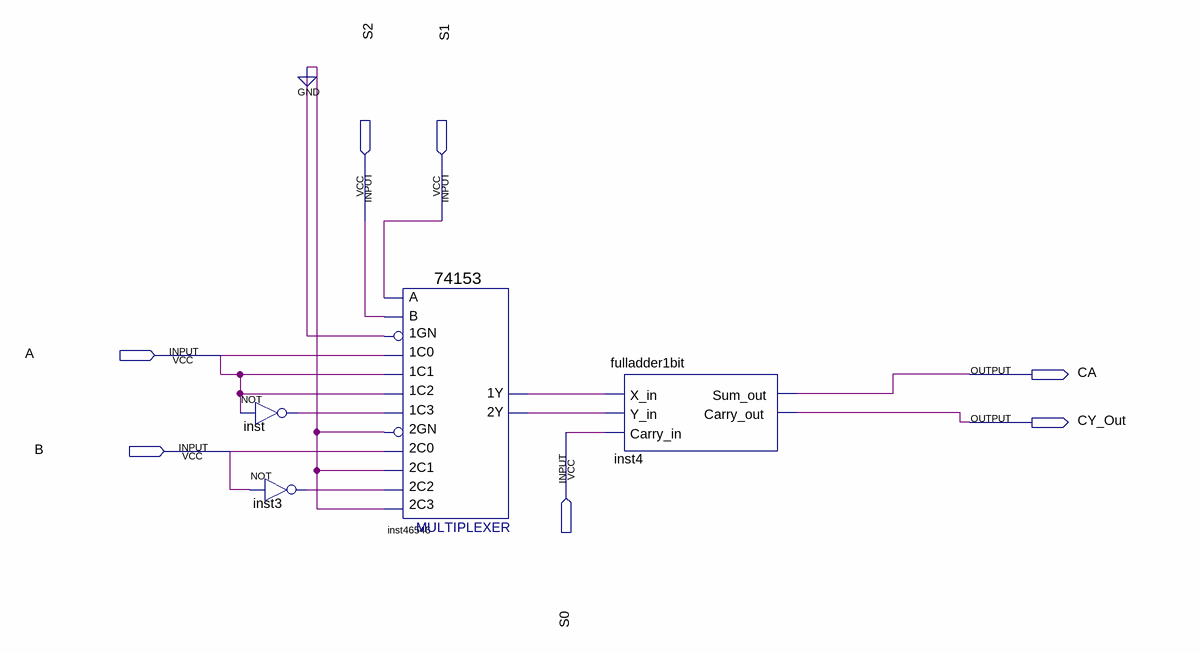
[diagram p0: schematic sheet]
// Quartus schematic arithcircuit1bit.bdf as structural Verilog: 4 symbols, 7 pins
module arithcircuit1bit (
  input  S2,
  input  S1,
  input  A,
  input  S0,
  input  B,
  output CA,
  output CY_Out
);

  wire inst3_out, inst46546_1y, inst46546_2y, inst_out;

  not inst (inst_out, A);
  not inst3 (inst3_out, B);
  \74153  inst46546 (
    .\1C1 (A), .\1GN (1'b0), .\1C0 (A), .\2C0 (B), .\2GN (1'b0), .\2C2 (inst3_out), .\1C2 (A),
    .\1C3 (inst_out), .B(S2), .A(S1), .\2C1 (1'b0), .\2C3 (1'b0), .\1Y (inst46546_1y), .\2Y (inst46546_2y));
  fulladder1bit inst4 (.X_in(inst46546_1y), .Y_in(inst46546_2y), .Carry_in(S0), .Sum_out(CA), .Carry_out(CY_Out));
endmodule
